# Altium schematic sheet FPGA_POWER.SchDoc (part 3 of 3)
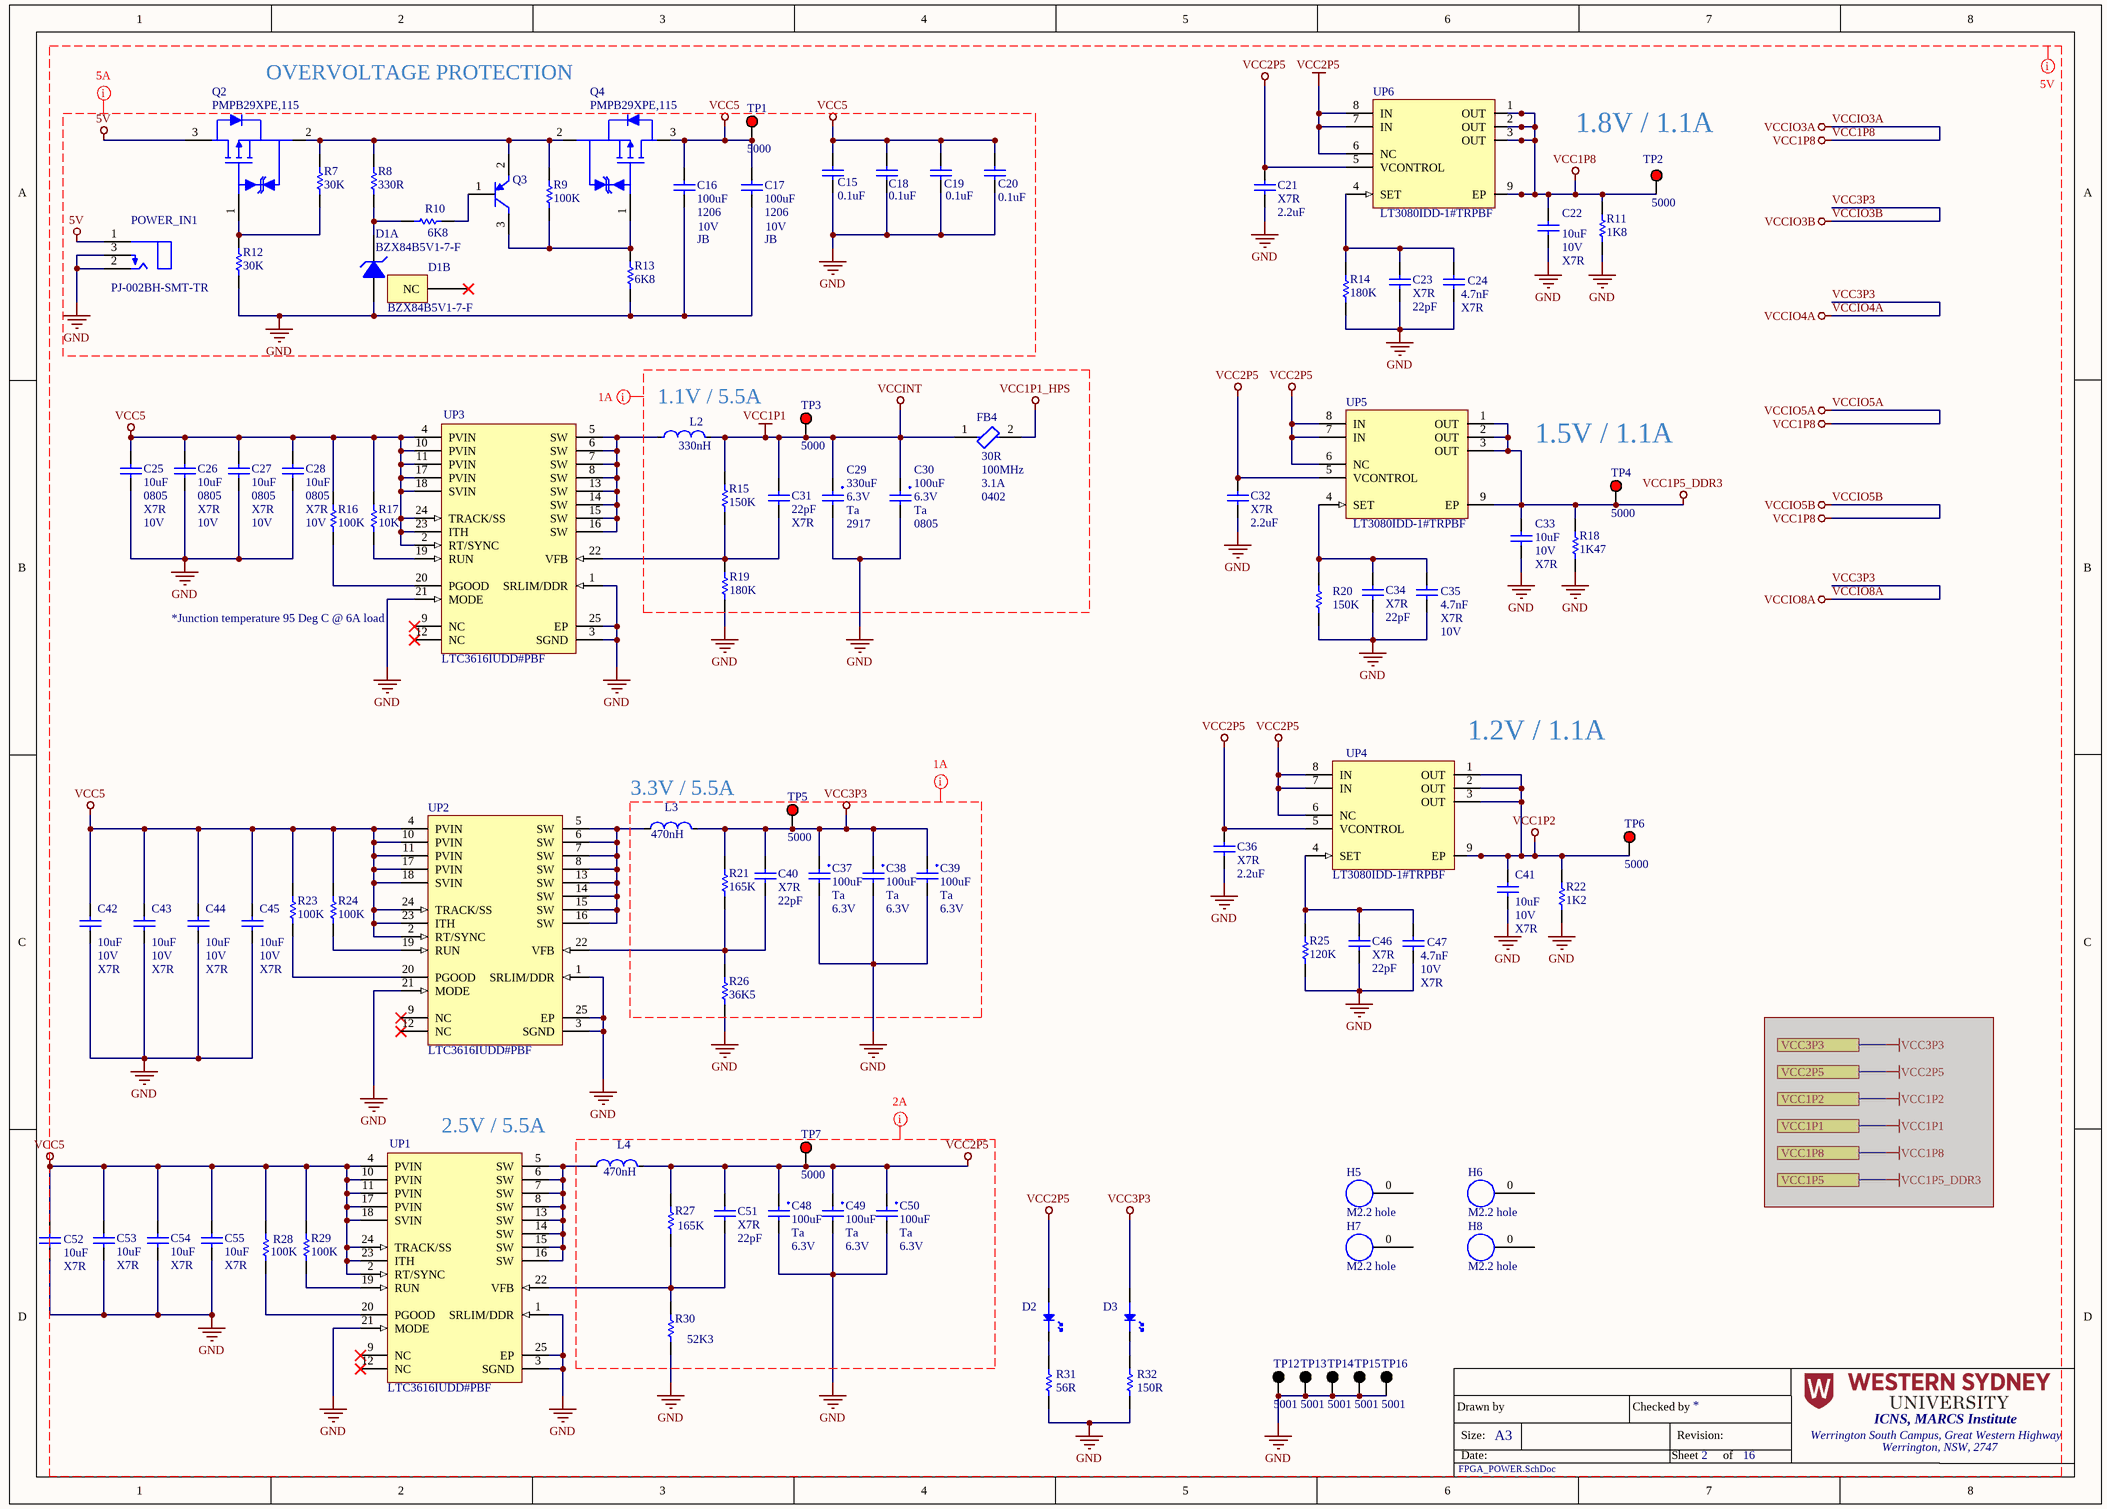
[diagram p2: FPGA_POWER.SchDoc]

## Library data of the parts (continued)
R31 = CMP-006-000016-1: Res Thick Film 0603 56 Ohms ±1% 0.125W, 1/8W Chip Resistor (1608 Metric) Automotive AEC-Q200; Manufacturer: Panasonic; Max Power Dissipation: 125mW; Temperature Coefficient: 100ppm/°C; RoHS: Yes; Case/Package: 0603; Case Code (Metric): 1608; Case Code (Imperial): 0603; Min Operating Temperature: -55°C; Max Operating Temperature: 175°C; Tolerance: 1%; Resistance: 56R; Category: Chip SMD Resistors; Stock: 5000; Pricing: 1=0.25000, 10=0.20900, 100=0.08170, 1000=0.03420, 2500=0.03135 (USD); Design Item ID: ERJH3EF56R0V; Number of Pins: 2; Power Rating: 125mW; Manufacturer Part Number: ERJH3EF56R0V; Source: ICNS_PropheseeLib.SchLib; Resistor Type: Thick Film
R32 = CMP-006-000018-1: Res Thick Film 0603 150 Ohm 1% Paper T/R Automotive Grade; Manufacturer: Yageo; Power Rating: 100mW; RoHS: Yes; Case Code (Metric): 1608; Case Code (Imperial): 0603; Tolerance: 1%; Resistance: 150R; Source: ICNS_PropheseeLib.SchLib; Pricing: 1=0.10000, 10=0.02900, 100=0.01170, 1000=0.00527, 2500=0.00458, 5000=0.00378 (USD); Design Item ID: AC0603FR-10150RL; Stock: 17930; Category: Chip SMD Resistors; RoHS Compliant: Yes; Manufacturer Part Number: AC0603FR-10150RL
TP1-TP7 = CMP-034-000000-1: MS27478 - Connectors Receptacle Electrical Solder Mounting Solder Type Hermetic Seal 38999 Series II; Manufacturer: Keystone Electronics; Body Material: PBT,Bronze; Hole Diameter: 1.6mm; Insulation: Insulated; Plating: Silver; Outside Diameter: 2.54mm; Inside Diameter: 1.27mm; Number of Ports: 1; Contact Material: Bronze; Contact Plating: Silver,Tin; Color: Red; Length: 7.62mm; ComponentLink3Description: https://datasheet.ciiva.com/16883/70182825-16883965.pdf?src-supplier=Allied+Electronics; Material: Nylon,Bronze,Silver; Design Item ID: 5000; ComponentLink1URL: https://datasheet.ciiva.com/11836/0900766b8009b7c7-11836046.pdf?src-supplier=RSComponents; Packaging: Bulk; ComponentLink1Description: https://datasheet.ciiva.com/11836/0900766b8009b7c7-11836046.pdf?src-supplier=RSComponents; Source: ICNS_PropheseeLib.SchLib; Category: Connectors; Housing Color: Red; RoHS: Yes; ComponentLink2URL: https://datasheet.ciiva.com/2917/5000-5004-2917627.pdf?src-supplier=Digi-Key; Package Quantity: 100; Series: THM; Flammability Rating: UL94 V-0; REACH SVHC: No SVHC; RoHS Compliant: Yes; Manufacturer Part Number: 5000; Pricing 1: 1=0.24600, 10=0.23700, 100=0.20900, 500=0.16600, 1000=0.14100, 2500=0.11600, 10000=0.10400 (USD); Number of Contacts: 1; Stock 1: 187141; Lead Free: Lead Free; Orientation: Straight; ComponentLink2Description: https://datasheet.ciiva.com/2917/5000-5004-2917627.pdf?src-supplier=Digi-Key; Mount: Through Hole,PCB; Height: 0.3inch; ComponentLink3URL: https://datasheet.ciiva.com/16883/70182825-16883965.pdf?src-supplier=Allied+Electronics
TP12-TP16 = CMP-000000-1: TEST POINT PC MINI .040D BLACK; Hole Diameter: 1.6mm; Insulation: Insulated; Number of Ports: 1; Body Material: Bronze; Outside Diameter: 2.54mm; Plating: Silver; Inside Diameter: 1.27mm; Termination: Through Hole; Flammability Rating: UL94 V-0; REACH SVHC: No SVHC; Contact Plating: Tin,Silver; Packaging: Bulk; Mount: Through Hole; Height: 0.3inch; Insulation Material: Nylon; Lead Free: Lead Free; Material: Nylon,Bronze,Silver; Number of Contacts: 1; Diameter: 2.54mm; Package Quantity: 100; Contact Material: Bronze; Length: 7.62mm; RoHS Compliant: Yes; Orientation: Straight; Housing Color: Black; Color: Black; Series: THM
UP1-UP3 = CMP-008-000016-1: Buck Switching Regulator IC Positive Adjustable 0.6V 1 Output 6A 24-WFQFN Exposed Pad; Manufacturer: Analog Devices / Linear Technology; Output Voltage: 5.5V; Min Input Voltage: 2.25V; Number of Outputs: 1; Switching Frequency: 4MHz; Synchronous Rectifier: Yes; Stock 1: 36; Pricing 1: 1=11.93000, 10=10.78000, 25=10.27840, 100=8.92460, 250=8.52344, 500=7.80450 (USD); RoHS: Yes; Case/Package: QFN; Number of Pins: 24; Min Operating Temperature: -40°C; Max Operating Temperature: 125°C; Package Quantity: 73; Output Current: 6A; Packaging: Rail/Tube; Output Type: Adjustable; ComponentLink1URL: https://datasheet.ciiva.com/14833/3616fa-14833785.pdf?src-supplier=Arrow+Electronics; ComponentLink1Description: https://datasheet.ciiva.com/14833/3616fa-14833785.pdf?src-supplier=Arrow+Electronics; ComponentLink2URL: https://datasheet.ciiva.com/2033/29078-2033302.pdf?src-supplier=Digi-Key; ComponentLink2Description: https://datasheet.ciiva.com/2033/29078-2033302.pdf?src-supplier=Digi-Key; Design Item ID: LTC3616IUDD#PBF; Source: ICNS_PropheseeLib.SchLib; Series: -; Manufacturer Part Number: LTC3616IUDD#PBF; Category: Voltage Regulators - Switching; RoHS Compliant: Yes
UP4-UP6 = CMP-008-000018-3: Linear Voltage Regulator IC Positive Adjustable 1 Output 1.1A 8-DFN (3x3); Manufacturer: Analog Devices / Linear Technology; Dropout Voltage: 1.35V; Number of Regulators: 1; Min Input Voltage: 1.2V; Max Input Voltage: 36V; Operating Supply Current: 300uA; ComponentLink1URL: http://components.arrow.com/part/dataview/51580031S9112172N7433?src-supplier=Arrow+Electronics; RoHS: Yes; ComponentLink2Description: http://www.linear.com/docs/26174?src-supplier=Digi-Key; ComponentLink2URL: http://www.linear.com/docs/26174?src-supplier=Digi-Key; ComponentLink1Description: http://components.arrow.com/part/dataview/51580031S9112172N7433?src-supplier=Arrow+Electronics; Category: Voltage Regulators - Linear; Max Operating Temperature: 125°C; Min Operating Temperature: -40°C; Package Quantity: 2500; Output Current: 1.1A; Output Voltage: 36V; Source: ICNS_PropheseeLib.SchLib; Case/Package: DFN; Min Current Limit: 1.1A; Packaging: Tape and Reel; Number of Pins: 8; Pricing 1: 1=6.49000, 10=5.82800, 25=5.50920, 100=4.77480, 250=4.52992, 500=4.06468, 1000=3.81150 (USD); RoHS Compliant: Yes; Design Item ID: LT3080IDD-1#TRPBF; Stock 1: 3032; Manufacturer Part Number: LT3080IDD-1#TRPBF